# EAGLE design SensorTile_Breakout (EAGLE 8.6.3)
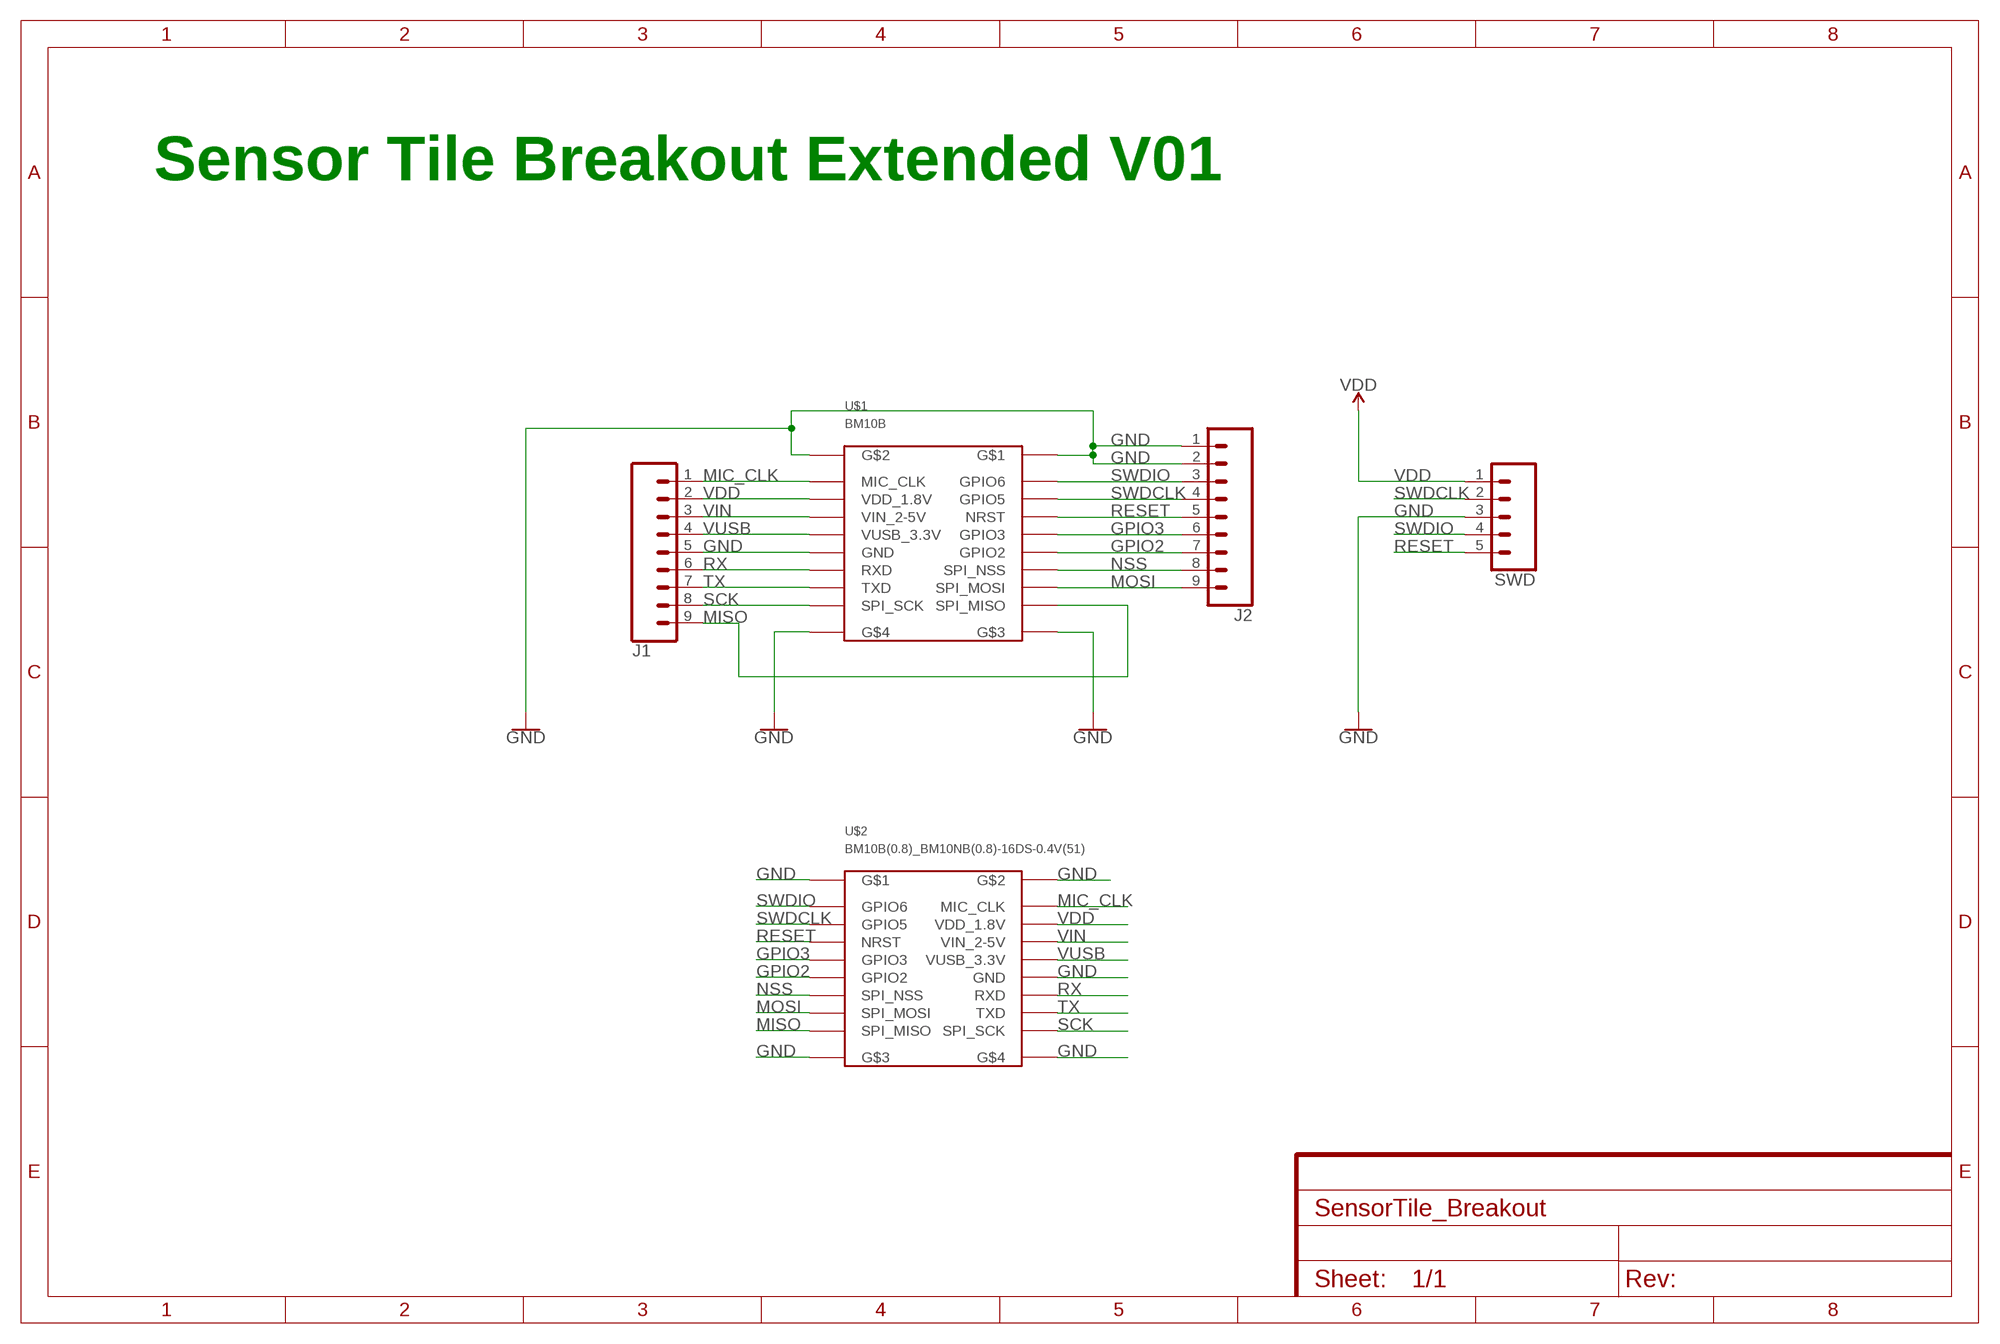
[diagram p0: schematic, sheet 1]

## Parts
J1  CONN_09  [1X09]
J2  CONN_09  [1X09]
SWD  CONN_05  [1X05]
U$1  BM10B  BM10B(0.8)-16DP-0.4V(51)  [BM10B(0.8)-16DP-0.4V(51)]
U$2  BM10B(0.8)_BM10NB(0.8)-16DS-0.4V(51)  [BM10B(0.8)_BM10NB(0.8)-16DS-0.4V(51)]

## Nets
GND: J1.5 J2.1 J2.2 SWD.3 U$1.G$1 U$1.G$2 U$1.G$3 U$1.G$4 U$1.GND$1(GND) U$2.G$1 U$2.G$2 U$2.G$3 U$2.G$4 U$2.GND$1(GND)
GPIO2: J2.7 U$1.GPIO2 U$2.GPIO2
GPIO3: J2.6 U$1.GPIO3 U$2.GPIO3
MIC_CLK: J1.1 U$1.MIC_CLK U$2.MIC_CLK
MISO: J1.9 U$1.SPI_MISO U$2.SPI_MISO
MOSI: J2.9 U$1.SPI_MOSI U$2.SPI_MOSI
NSS: J2.8 U$1.SPI_NSS U$2.SPI_NSS
RESET: J2.5 SWD.5 U$1.NRST U$2.NRST
RX: J1.6 U$1.RXD U$2.RXD
SCK: J1.8 U$1.SPI_SCK U$2.SPI_SCK
SWDCLK: J2.4 SWD.2 U$1.GPIO5 U$2.GPIO5
SWDIO: J2.3 SWD.4 U$1.GPIO6 U$2.GPIO6
TX: J1.7 U$1.TXD U$2.TXD
VDD: J1.2 SWD.1 U$1.VDD_1.8V U$2.VDD_1.8V
VIN: J1.3 U$1.VIN_2-5V U$2.VIN_2-5V
VUSB: J1.4 U$1.VUSB_3.3V U$2.VUSB_3.3V

## Notes on the sheet
- Sensor Tile Breakout Extended V01

## Library data of the parts
J1 J2 = SparkFun-Connectors:CONN_09: Multi connection point. Often used as Generic Header-pin footprint for 0.1 inch spaced/style header connections On any of the 0.1 inch spaced packages, you can populate with these: Break Away Headers - Straight <https://www.sparkfun.com/products/116> (PRT-00116) Break Away Male Headers - Right Angle <https://www.sparkfun.com/products/553> (PRT-00553) Female Headers <https://www.sparkfun.com/products/115> (PRT-00115) Break Away Headers - Machine Pin <https://www.sparkfun.com/products/117> (PRT-00117) Break Away Female Headers - Swiss Machine Pin <https://www.sparkfun.com/products/743> (PRT-00743) For SCREWTERMINALS and SPRING TERMINALS visit here: Screw Terimnals on SparkFun.com <https://www.sparkfun.com/search/results?term=Screw+Terminals> (5mm/3.5mm/2.54mm spacing) This device is also useful as a general connection point to wire up your design to another part of your project. Our various solder wires solder well into these plated through hole pads. Hook-Up Wire - Assortment (Stranded, 22 AWG) <https://www.sparkfun.com/products/11375> (PRT-11375) Hook-Up Wire - Assortment (Solid Core, 22 AWG) <https://www.sparkfun.com/products/11367> (PRT-11367) View the entire wire category on our website here <https://www.sparkfun.com/categories/141> Special notes: Molex polarized connector foot print use with SKU : PRT-08231 with associated crimp pins and housings. 1MM SMD Version SKU: PRT-10208 NOTES ON THE VARIANTS LOCK and LOCK_LONGPADS... This footprint was designed to help hold the alignment of a through-hole component (i.e. 6-pin header) while soldering it into place. You may notice that each hole has been shifted either up or down by 0.005 of an inch from it's more standard position (which is a perfectly straight line). This slight alteration caused the pins (the squares in the middle) to touch the edges of the holes. Because they are alternating, it causes a "brace" to hold the component in place. 0.005 has proven to be the perfect amount of "off-center" position when using our standard breakaway headers. Although looks a little odd when you look at the bare footprint, once you have a header in there, the alteration is very hard to notice. Also,if you push a header all the way into place, it is covered up entirely on the bottom side.
SWD = SparkFun-Connectors:CONN_05: Multi connection point. Often used as Generic Header-pin footprint for 0.1 inch spaced/style header connections On any of the 0.1 inch spaced packages, you can populate with these: Break Away Headers - Straight <https://www.sparkfun.com/products/116> (PRT-00116) Break Away Male Headers - Right Angle <https://www.sparkfun.com/products/553> (PRT-00553) Female Headers <https://www.sparkfun.com/products/115> (PRT-00115) Break Away Headers - Machine Pin <https://www.sparkfun.com/products/117> (PRT-00117) Break Away Female Headers - Swiss Machine Pin <https://www.sparkfun.com/products/743> (PRT-00743) For SCREWTERMINALS and SPRING TERMINALS visit here: Screw Terimnals on SparkFun.com <https://www.sparkfun.com/search/results?term=Screw+Terminals> (5mm/3.5mm/2.54mm spacing) This device is also useful as a general connection point to wire up your design to another part of your project. Our various solder wires solder well into these plated through hole pads. Hook-Up Wire - Assortment (Stranded, 22 AWG) <https://www.sparkfun.com/products/11375> (PRT-11375) Hook-Up Wire - Assortment (Solid Core, 22 AWG) <https://www.sparkfun.com/products/11367> (PRT-11367) View the entire wire category on our website here <https://www.sparkfun.com/categories/141> Special notes: Molex polarized connector foot print use with SKU : PRT-08231 with associated crimp pins and housings. 1MM SMD Version SKU: PRT-10208
U$1 = BM10B(0.8):BM10B(0.8)-16DP-0.4V(51)
U$2 = BM10B(0.8):BM10B(0.8)_BM10NB(0.8)-16DS-0.4V(51): BM10NB(0.8)-16DS-0.4V(51) Digikey: ‏‎H11823CT-ND‎‏

## Board
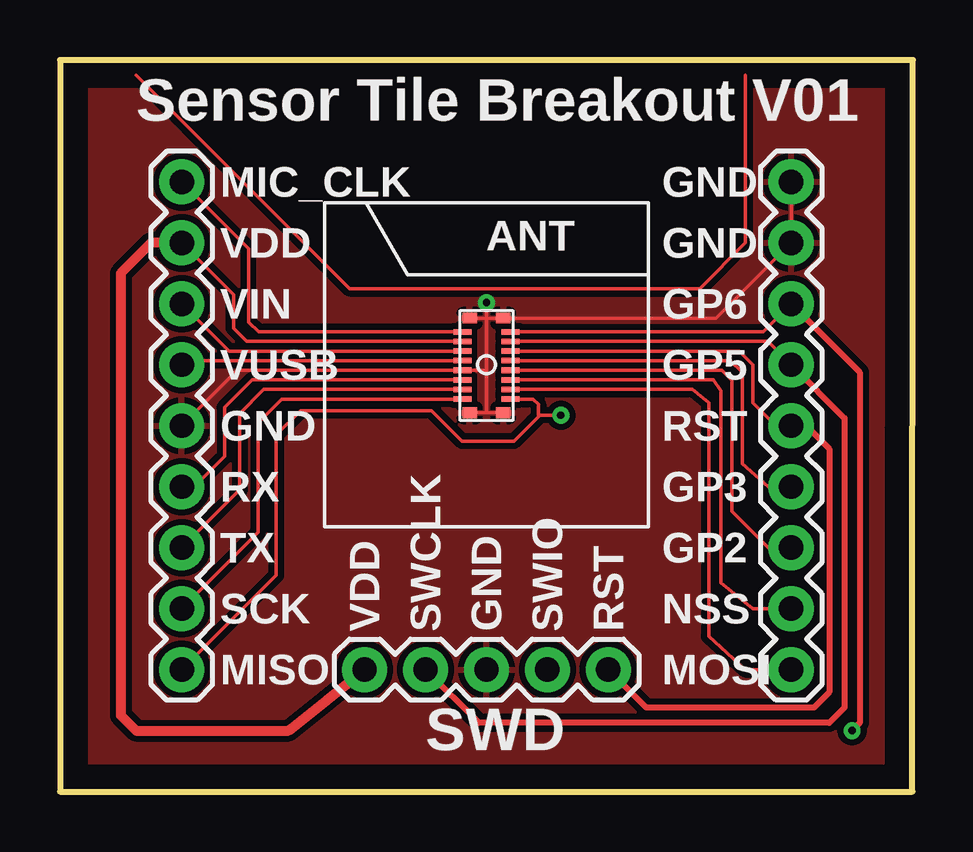
[diagram p1: board, top side]
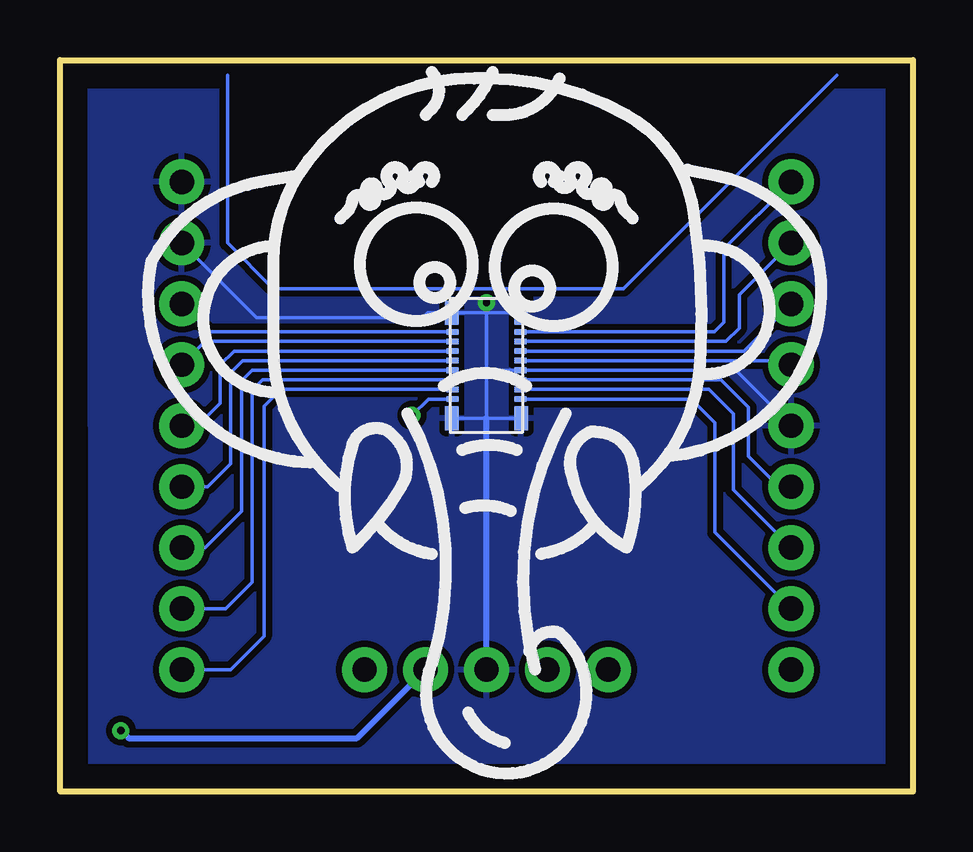
[diagram p2: board, bottom side, seen from below]

Size 35.56 x 30.48 mm. Coordinates in mm from the lower left corner, seen from the top.
Outline: 0,0 35.54,0 35.56,30.48 0,30.48 0,0
Copper layers (1*16): Top 0.035mm / dielectric 1.5mm / Bottom 0.035mm
Design rules "default *": minimum track width 6mil, minimum drill 0.3mm, track to track 6mil, track to pad 6mil, pad to pad 6mil, via to via 6mil, smd to smd 6mil, copper to edge 40mil, drill to drill 6mil, minimum pad ring 10mil, minimum via ring 8mil, stop-mask expansion 4mil, vias tented up to drill 20mil, thermal gap 10mil

### Footprints (pad centres in the part's own frame; a part is rotated, then mirrored left to right if it is on the bottom)
1X09 = drill 1.016 pad 1.88: 1 0,0; 2 2.54,0; 3 5.08,0; 4 7.62,0; 5 10.16,0; 6 12.7,0; 7 15.24,0; 8 17.78,0; 9 20.32,0
1X05 = drill 1.016 pad 1.88: 1 0,0; 2 2.54,0; 3 5.08,0; 4 7.62,0; 5 10.16,0
BM10B(0.8)-16DP-0.4V(51) = smd 0.6 x 0.44: G$1 0.7,3.37; G$2 -0.7,3.37; G$3 0.7,-0.57; G$4 -0.7,-0.57 | smd 0.75 x 0.23: GND$1 -1,1.2; GPIO2 1,1.2; GPIO3 1,1.6; GPIO5 1,2.4; GPIO6 1,2.8; MIC_CLK -1,2.8; NRST 1,2; RXD -1,0.8; SPI_MISO 1,0; SPI_MOSI 1,0.4; SPI_NSS 1,0.8; SPI_SCK -1,0; TXD -1,0.4; VDD_1.8V -1,2.4; VIN_2-5V -1,2; VUSB_3.3V -1,1.6
BM10B(0.8)_BM10NB(0.8)-16DS-0.4V(51) = smd 0.55 x 1: G$1 1.445,3.59; G$2 -1.445,3.59; G$3 1.445,-0.79; G$4 -1.445,-0.79 | smd 0.5 x 0.23: GND$1 1.42,1.2; GPIO2 -1.42,1.2; GPIO3 -1.42,1.6; GPIO5 -1.42,2.4; GPIO6 -1.42,2.8; MIC_CLK 1.42,2.8; NRST -1.42,2; RXD 1.42,0.8; SPI_MISO -1.42,0; SPI_MOSI -1.42,0.4; SPI_NSS -1.42,0.8; SPI_SCK 1.42,0; TXD 1.42,0.4; VDD_1.8V 1.42,2.4; VIN_2-5V 1.42,2; VUSB_3.3V 1.42,1.6

### Placement (x,y rotation side)
J1  5.08,25.4 270 top
J2  30.48,25.4 270 top
SWD  12.7,5.08 0 top
U$1  17.78,16.35 0 top
U$2  17.78,16.35 0 bottom

### Tracks (layer width: path | path; a pad name or v marks a point on that pad's centre or on a via)
GND  (via drill 0.3)
  Top 0.152: J1.5 7.39,17.55 U$1.GND$1 17.75,17.55 17.78,17.53 | U$1.G$2 17.78,19.72 | 17.78,19.72 U$1.G$1 27.34,19.72 J2.2 J2.1 | U$1.G$4 17.78,15.78 | 17.78,15.78 U$1.G$3 | 17.78,15.78 17.78,17.53 | 17.78,17.53 17.78,19.72 | v17.78,20.37 17.78,19.72
  Bottom 0.152: U$2.G$3 17.78,15.56 | 17.78,15.56 U$2.G$4 | U$2.G$1 17.78,19.94 | 17.78,19.94 U$2.G$2 20.24,19.94 20.47,19.74 27.36,19.74 J2.2 | 17.78,15.56 17.78,17.46 | 17.78,17.46 17.78,19.94 | 17.78,17.46 17.69,17.55 U$2.GND$1 7.39,17.55 J1.5 | 17.78,19.94 v17.78,20.37
  Bottom 0.254: SWD.3 17.78,15.56
  pour Bottom (isolate 0.254): 0.64,29.84 0.64,0.64 34.92,0.64 34.92,29.84
  pour Top (isolate 0.254): 0.64,29.84 0.64,0.64 34.92,0.64 34.92,29.84
GPIO2
  Top 0.152: U$1.GPIO2 27.6,17.55 28,17.14 28,11.68 29.53,10.16 J2.7
  Bottom 0.152: U$2.GPIO2 27.56,17.55 27.99,17.12 27.99,11.68 29.52,10.16 J2.7
GPIO3
  Top 0.152: U$1.GPIO3 27.96,17.95 28.45,17.46 28.45,13.65 29.53,12.7 J2.6
  Bottom 0.152: U$2.GPIO3 27.95,17.95 28.45,17.45 28.45,13.66 29.41,12.7 J2.6
MIC_CLK
  Top 0.152: U$1.MIC_CLK 8.28,19.15 7.87,19.56 7.87,22.61 J1.1
  Bottom 0.152: U$2.MIC_CLK 8.28,19.15 7.87,19.56 7.87,22.61 J1.1
MISO  (via drill 0.3)
  Top 0.152: U$1.SPI_MISO 19.71,16.35 19.94,16.13 19.94,15.62 | 19.94,15.62 19.71,15.39 18.92,14.61 16.76,14.61 15.49,15.88 10.03,15.88 9.02,14.86 9.02,9.02 J1.9 | v20.88,15.67 19.99,15.67 19.94,15.62
  Bottom 0.152: U$2.SPI_MISO 20.2,16.35 v20.88,15.67
MOSI
  Top 0.152: U$1.SPI_MOSI 26.36,16.75 27.05,16.19 27.05,6.48 28.57,5.08 J2.9
  Bottom 0.152: U$2.SPI_MOSI 26.35,16.75 27.05,16.05 27.05,6.48 28.45,5.08 J2.9
N$1
  Top 0.152: 3.17,29.84 12.06,20.95 26.67,20.95 28.57,22.86 28.57,29.84
N$2
  Bottom 0.152: 3.17,29.84 12.06,20.95 26.67,20.95 28.57,22.86 28.57,29.84
NSS
  Top 0.152: U$1.SPI_NSS 27.23,17.15 27.56,16.7 27.56,8.7 28.89,7.62 J2.8
  Bottom 0.152: U$2.SPI_NSS 27.12,17.15 27.56,16.71 27.56,8.71 28.65,7.62 J2.8
RESET
  Top 0.152: U$1.NRST 28.32,18.35 28.89,17.78 28.89,16.19 29.84,15.24 J2.5
  Top 0.254: J2.5 31.11,15.24 32.07,14.29 32.07,4.13 31.43,3.49 24.45,3.49 SWD.5
  Bottom 0.152: U$2.NRST 28.31,18.35 28.88,17.78 28.88,16.18 29.82,15.24 J2.5
RX
  Top 0.152: U$1.RXD 8.01,17.15 6.86,16 6.86,13.97 5.59,12.7 J1.6
  Bottom 0.152: U$2.RXD 8.01,17.15 6.86,16 6.86,13.97 5.59,12.7 J1.6
SCK
  Top 0.152: U$1.SPI_SCK 9.24,16.35 8.26,15.37 8.26,10.79 J1.8
  Bottom 0.152: U$2.SPI_SCK 9.24,16.35 8.26,15.37 8.26,10.79 J1.8
SWDCLK
  Top 0.152: U$1.GPIO5 29.51,18.75 J2.4
  Top 0.254: J2.4 32.7,15.56 32.7,3.49 32.07,2.86 17.46,2.86 SWD.2
  Bottom 0.152: U$2.GPIO5 29.51,18.75 J2.4
SWDIO  (via drill 0.3)
  Top 0.152: U$1.GPIO6 29.31,19.15 J2.3
  Top 0.254: J2.3 33.34,17.46 33.34,2.86 v33.02,2.54
  Bottom 0.152: U$2.GPIO6 29.31,19.15 J2.3
  Bottom 0.254: v33.02,2.54 32.7,2.22 23.18,2.22 SWD.4
TX
  Top 0.152: U$1.TXD 8.5,16.75 7.49,15.75 7.49,12.57 J1.7
  Bottom 0.152: U$2.TXD 8.5,16.75 7.49,15.75 7.49,12.57 J1.7
VDD
  Top 0.152: U$1.VDD_1.8V 7.79,18.75 7.24,19.3 7.24,20.7 J1.2
  Top 0.406: J1.2 3.81,22.86 2.54,21.59 2.54,3.17 3.17,2.54 9.53,2.54 SWD.1
  Bottom 0.152: U$2.VDD_1.8V 7.79,18.75 7.24,19.3 7.24,20.7 J1.2
VIN
  Top 0.152: U$1.VIN_2-5V 7.05,18.35 J1.3
  Bottom 0.152: U$2.VIN_2-5V 7.05,18.35 J1.3
VUSB
  Top 0.152: U$1.VUSB_3.3V 5.25,17.95 J1.4
  Bottom 0.152: U$2.VUSB_3.3V 5.25,17.95 J1.4

### Text on the board
tPlace: Sensor Tile Breakout V01 | MIC_CLK | GND | ANT | VDD | GND | VIN | GP6 | VUSB | GP5 | GND | RST | RX | GP3 | TX | GP2 | SCK | VDD | SWCLK | GND | SWIO | RST | NSS | MISO | MOSI